# Altium schematic sheet MicrocontrollerPorts.SchDoc: MICROCONTROLLER - PORTS
size A4; Author: MOG; CompanyName: GIE GROUP; DrawnBy: MOG; Organization: Gie SA; Address1: Galicia 52; Address2: Mar del Plata; Address3: Buenos Aires; Address4: Argentina; DocumentNumber: 11; Revision: 0.0; SheetNumber: 10; SheetTotal: 14; Project: CP DATALOGGER; PageSetup: Record=PageOptions|CenterHorizontal=True|CenterVertical=True|PrintScale=0.94|XCorrection=1.00|YCorrection=1.00|PrintKind=0|BorderSize=5000000|LeftOffset=0|BottomOffset=0|Orientation=2|PaperLength=1000|PaperWidth=1000|Scale=100|PaperSource=7|PrintQuality=720|MediaType=1|DitherType=10|PaperKind=A4|PrintScaleMode=1
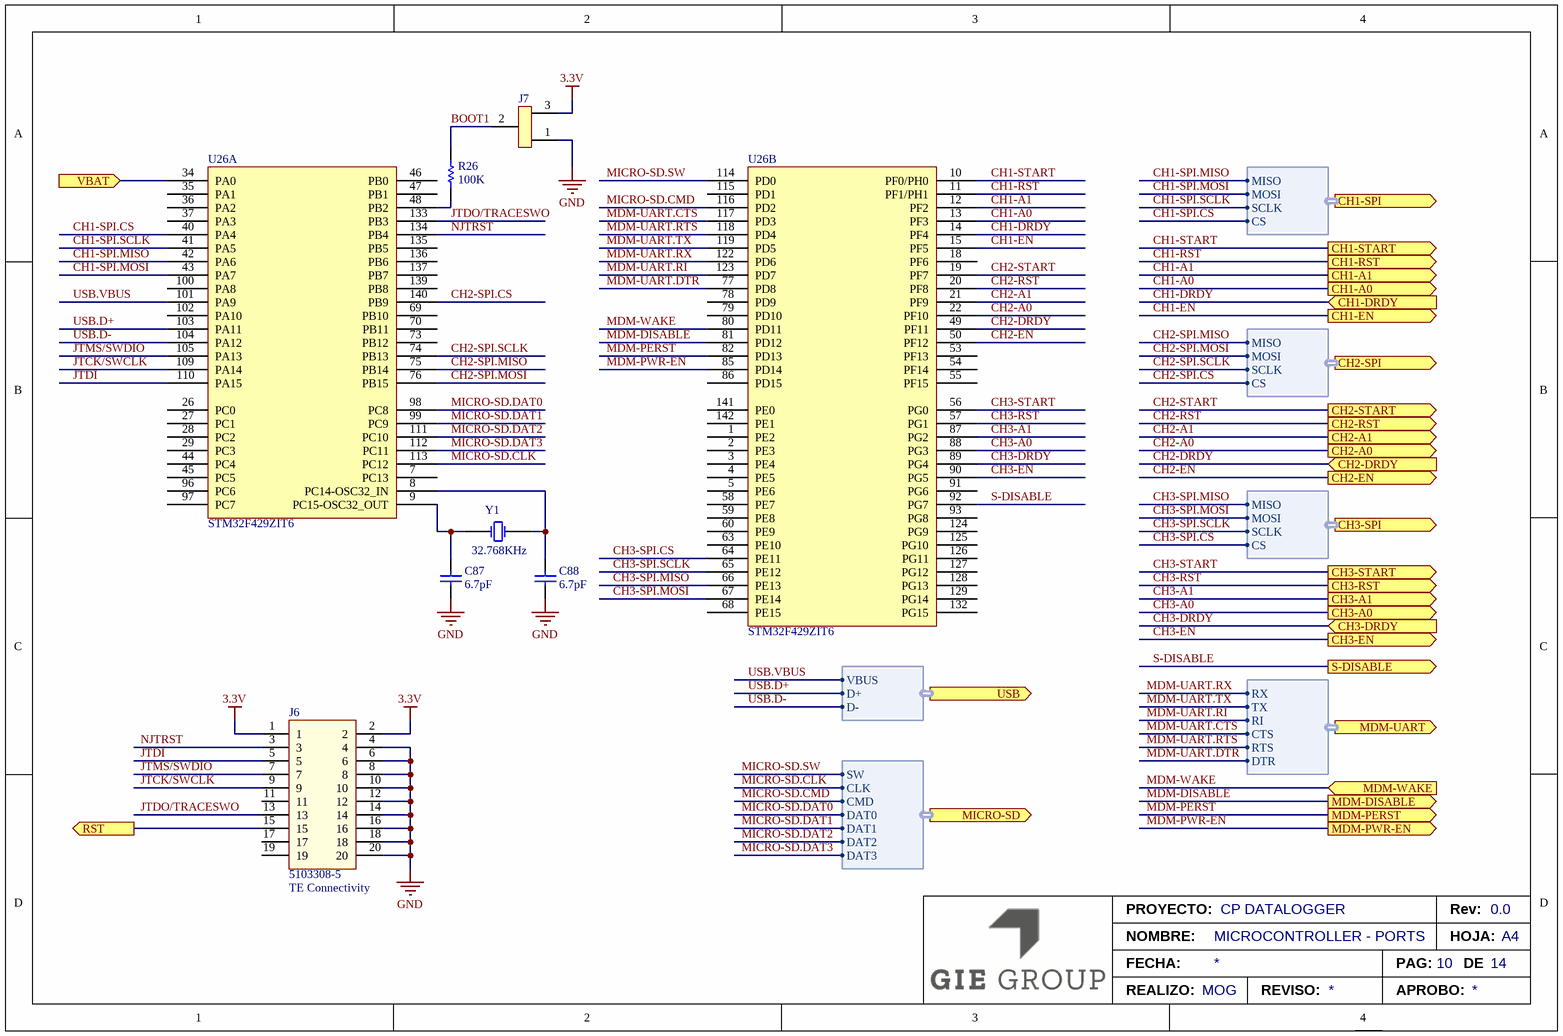
[diagram p0: MicrocontrollerPorts.SchDoc]

## Parts
C87  value 6.7pF  [CAP-0603]  (hidden comment: CBR06C679B5GAC)
C88  value 6.7pF  [CAP-0603]  (hidden comment: CBR06C679B5GAC)
J6  Manufacturer: TE Connectivity  [TE-5103308-5]  (hidden comment: 5103308-5)
J7  PRPC003SAAN-RC  [PIN3]  (value not drawn)
R26  value 100K  [RES-0603]  (hidden comment: RC0603FR-07100KL)
U26  STM32F429ZIT6  [LQFP144]  (parts A,B of 3)
Y1  value 32.768KHz  [XTAL-ABS07]  (hidden comment: ABS07-32.768KHZ-7-T)

## Ports
CH1-A0 (out), CH1-A1 (out), CH1-DRDY (in), CH1-EN (out), CH1-RST (out), CH1-SPI (out, harness CH1-SPI), CH1-START (out), CH2-A0 (out), CH2-A1 (out), CH2-DRDY (in), CH2-EN (out), CH2-RST (out), CH2-SPI (out, harness CH2-SPI), CH2-START (out), CH3-A0 (out), CH3-A1 (out), CH3-DRDY (in), CH3-EN (out), CH3-RST (out), CH3-SPI (out, harness CH3-SPI), CH3-START (out), MDM-DISABLE (out), MDM-PERST (out), MDM-PWR-EN (out), MDM-UART (out, harness MDM-UART), MDM-WAKE (in), MICRO-SD (out, harness MICRO-SD), RST (out), S-DISABLE (out), USB (out, harness USB), VBAT (in)

## Harnesses
CH1-SPI: MOSI, MISO, SCLK, CS
CH2-SPI: MOSI, MISO, SCLK, CS
CH3-SPI: MOSI, MISO, SCLK, CS
MDM-UART: RX, TX, RI, CTS, RTS, DTR
USB: D-, D+, VBUS
MICRO-SD: SW, CLK, CMD, DAT0, DAT1, DAT2, DAT3

## Nets
3.3V: J6.1 J6.2 J7.3
GND: C87.1 C88.1 J6.4 J6.6 J6.8 J6.10 J6.12 J6.14 J6.16 J6.18 J6.20 J7.1
BOOT1: J7.2 R26.2
CH1-A0: U26.13(PF3) ; port CH1-A0
CH1-A1: U26.12(PF2) ; port CH1-A1
CH1-DRDY: U26.14(PF4) ; port CH1-DRDY
CH1-EN: U26.15(PF5) ; port CH1-EN
CH1-RST: U26.11(PF1/PH1) ; port CH1-RST
CH1-SPI.CS: U26.40(PA4) ; port CH1-SPI.CS
CH1-SPI.MISO: U26.42(PA6) ; port CH1-SPI.MISO
CH1-SPI.MOSI: U26.43(PA7) ; port CH1-SPI.MOSI
CH1-SPI.SCLK: U26.41(PA5) ; port CH1-SPI.SCLK
CH1-START: U26.10(PF0/PH0) ; port CH1-START
CH2-A0: U26.22(PF10) ; port CH2-A0
CH2-A1: U26.21(PF9) ; port CH2-A1
CH2-DRDY: U26.49(PF11) ; port CH2-DRDY
CH2-EN: U26.50(PF12) ; port CH2-EN
CH2-RST: U26.20(PF8) ; port CH2-RST
CH2-SPI.CS: U26.140(PB9) ; port CH2-SPI.CS
CH2-SPI.MISO: U26.75(PB14) ; port CH2-SPI.MISO
CH2-SPI.MOSI: U26.76(PB15) ; port CH2-SPI.MOSI
CH2-SPI.SCLK: U26.74(PB13) ; port CH2-SPI.SCLK
CH2-START: U26.19(PF7) ; port CH2-START
CH3-A0: U26.88(PG3) ; port CH3-A0
CH3-A1: U26.87(PG2) ; port CH3-A1
CH3-DRDY: U26.89(PG4) ; port CH3-DRDY
CH3-EN: U26.90(PG5) ; port CH3-EN
CH3-RST: U26.57(PG1) ; port CH3-RST
CH3-SPI.CS: U26.64(PE11) ; port CH3-SPI.CS
CH3-SPI.MISO: U26.66(PE13) ; port CH3-SPI.MISO
CH3-SPI.MOSI: U26.67(PE14) ; port CH3-SPI.MOSI
CH3-SPI.SCLK: U26.65(PE12) ; port CH3-SPI.SCLK
CH3-START: U26.56(PG0) ; port CH3-START
JTCK/SWCLK: J6.9 U26.109(PA14)
JTDI: J6.5 U26.110(PA15)
JTDO/TRACESWO: J6.13 U26.133(PB3)
JTMS/SWDIO: J6.7 U26.105(PA13)
MDM-DISABLE: U26.81(PD12) ; port MDM-DISABLE
MDM-PERST: U26.82(PD13) ; port MDM-PERST
MDM-PWR-EN: U26.85(PD14) ; port MDM-PWR-EN
MDM-UART.CTS: U26.117(PD3) ; port MDM-UART.CTS
MDM-UART.DTR: U26.77(PD8) ; port MDM-UART.DTR
MDM-UART.RI: U26.123(PD7) ; port MDM-UART.RI
MDM-UART.RTS: U26.118(PD4) ; port MDM-UART.RTS
MDM-UART.RX: U26.122(PD6) ; port MDM-UART.RX
MDM-UART.TX: U26.119(PD5) ; port MDM-UART.TX
MDM-WAKE: U26.80(PD11) ; port MDM-WAKE
MICRO-SD.CLK: U26.113(PC12) ; port MICRO-SD.CLK
MICRO-SD.CMD: U26.116(PD2) ; port MICRO-SD.CMD
MICRO-SD.DAT0: U26.98(PC8) ; port MICRO-SD.DAT0
MICRO-SD.DAT1: U26.99(PC9) ; port MICRO-SD.DAT1
MICRO-SD.DAT2: U26.111(PC10) ; port MICRO-SD.DAT2
MICRO-SD.DAT3: U26.112(PC11) ; port MICRO-SD.DAT3
MICRO-SD.SW: U26.114(PD0) ; port MICRO-SD.SW
NJTRST: J6.3 U26.134(PB4)
RST: J6.15 ; port RST
S-DISABLE: U26.92(PG7) ; port S-DISABLE
USB.D+: U26.103(PA11) ; port USB.D+
USB.D-: U26.104(PA12) ; port USB.D-
USB.VBUS: U26.101(PA9) ; port USB.VBUS
VBAT: U26.34(PA0) ; port VBAT
NetC87_2: C87.2 U26.9(PC15-OSC32_OUT) Y1.2(OSC2)
NetC88_2: C88.2 U26.8(PC14-OSC32_IN) Y1.1(OSC1)
NetR26_1: R26.1 U26.48(PB2)

Not connected (* = marked no-connect by the designer): J6 11 17 19; U26 1(PE2) 2(PE3) 3(PE4) 4(PE5) 5(PE6) 7(PC13) 18(PF6) 26(PC0) 27(PC1) 28(PC2) 29(PC3) 35(PA1) 36(PA2) 37(PA3) 44(PC4) 45(PC5) 46(PB0) 47(PB1) 53(PF13) 54(PF14) 55(PF15) 58(PE7) 59(PE8) 60(PE9) 63(PE10) 68(PE15) 69(PB10) 70(PB11) 73(PB12) 78(PD9) 79(PD10) 86(PD15) 91(PG6) 93(PG8) 96(PC6) 97(PC7) 100(PA8) 102(PA10) 115(PD1) 124(PG9) 125(PG10) 126(PG11) 127(PG12) 128(PG13) 129(PG14) 132(PG15) 135(PB5) 136(PB6) 137(PB7) 139(PB8) 141(PE0) 142(PE1)

## Notes on the sheet
- PROYECTO:
- Rev:
- NOMBRE:
- FECHA:
- REALIZO:
- REVISO:
- APROBO:
- PAG:
- HOJA:
- DE
- A4

## Library data of the parts
C87 C88 = CBR06C679B5GAC: CAP CER 6.7 pF 50V C0G 0603; Manufacturer: Kemet; Tolerance: +/-0.1pF; PartNumber: CBR06C679B5GAC; Supplier 1: Digi-Key; Supplier 2: Mouser; Supplier Part Number 1: 399-C0805C155K4RAC7800CT-ND; Supplier Part Number 2: 80-C0805C155K4R; Voltage: 50V
J6 = 5103308-5: CONN HEADER VERT 20POS 2.54MM; PartNumber: 5103308-5
J7 = PRPC003SAAN-RC: CONN HEADER .100" SNGL STR 3POS; Manufacturer: Sullins Connector Solutions; PartNumber: PRPC003SAAN-RC; Supplier 1: Digi-Key; Supplier Part Number 1: S1011EC-03-ND
R26 = RC0603FR-07100KL: RES SMD 100K OHM 1% 1/10W 0603; Manufacturer: Yageo; Power: 0.1W; Tolerance: 1%; PartNumber: RC0603FR-07100KL; Supplier 1: Digi-Key; Supplier 2: Mouser; Supplier Part Number 1: 311-100KHRCT-ND; Supplier Part Number 2: 603-RC0603FR-07100KL
U26 = STM32F429ZIT6: IC MCU 32BIT 2MB FLASH 144LQFP; Manufacturer: STMicroelectronics; PartNumber: STM32F429ZIT6
Y1 = ABS07-32.768KHZ-7-T: CRYSTAL 32.768KHZ 7PF SMD; Manufacturer: Abracon; PartNumber: ABS07-32.768KHZ-7-T; Supplier 1: Digi-Key; Supplier Part Number 1: 535-9543-1-ND; Supplier 2: Mouser; Supplier Part Number 2: 815-ABS07-32.768K7T